# Altium schematic sheet DIPSY_UL1K16.SchDoc: DIPSY EASYSOLDER
size A4; Organization: Trenz Electronic GmbH; DocumentNumber: 1; Revision: 02; SheetNumber: 1; SheetTotal: 1; Date: 2015-09-20; Author: Antti Lukats; DrawnBy: Antti Lukats; Engineer: Antti Lukats
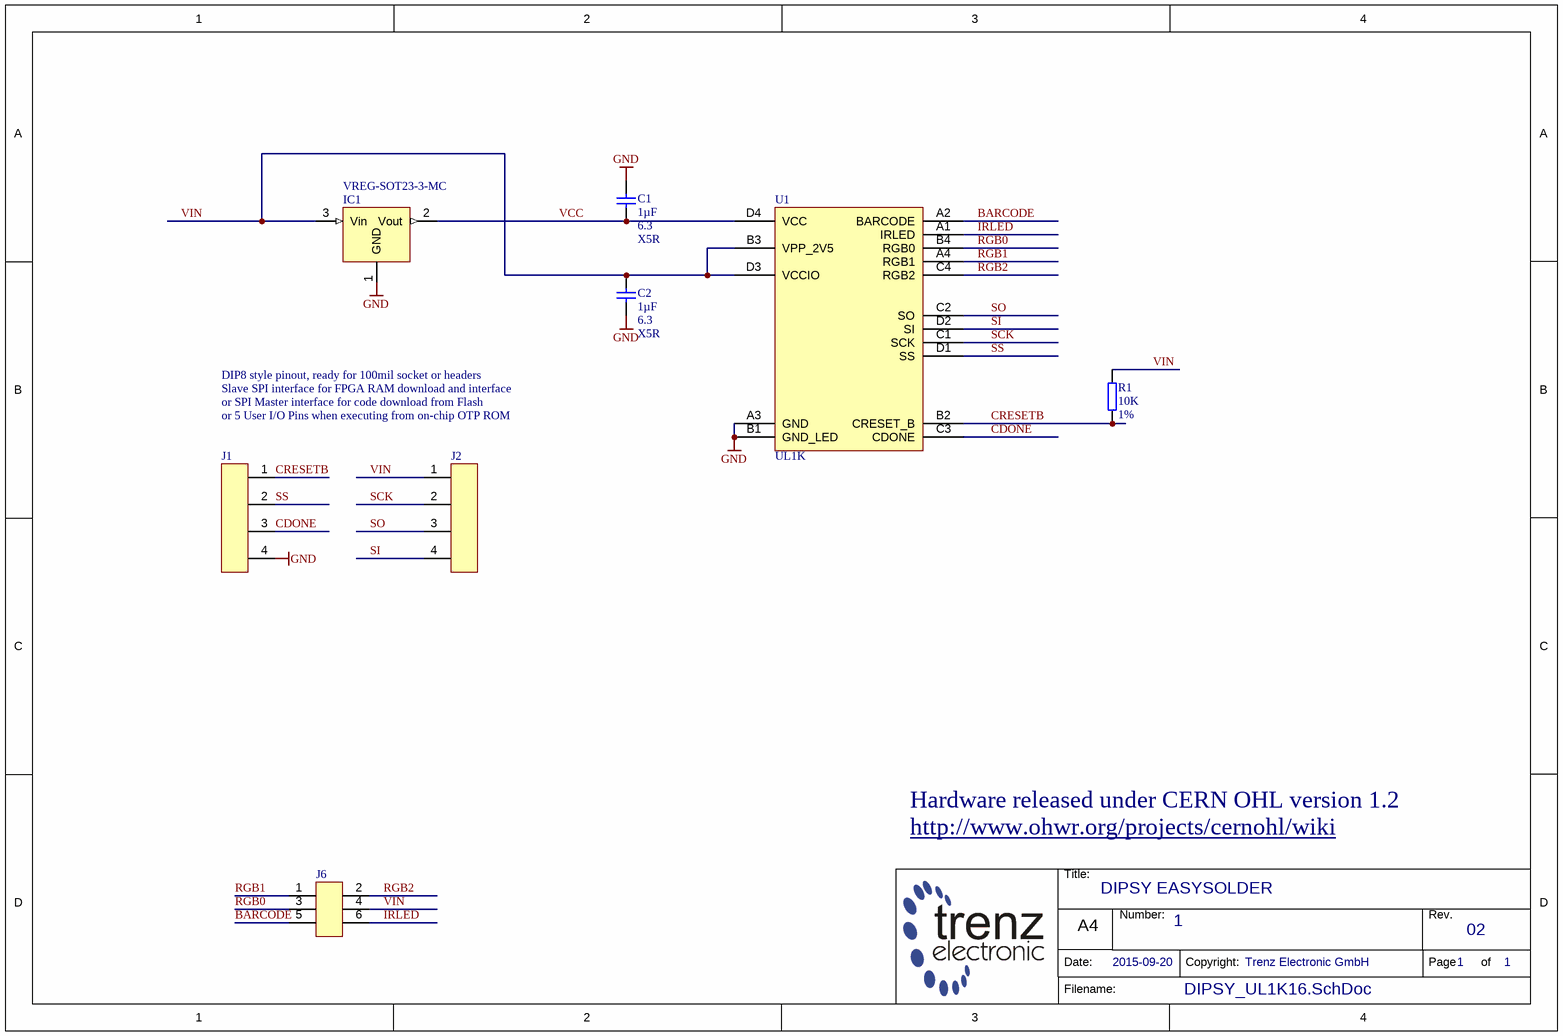
[diagram p0: DIPSY_UL1K16.SchDoc]

## Parts
C1  1µF  Voltage: 6.3  Technology: X5R  [CAPC1005X55N]
C2  1µF  Voltage: 6.3  Technology: X5R  [CAPC1005X55N]
IC1  VREG-SOT23-3-MC  [SOT23]
J1  Pin Header 2.54 1Row 4Pins  [STIFTLEISTE2_54 OG 1R-4]  (value not drawn)
J2  Pin Header 2.54 1Row 4Pins  [STIFTLEISTE2_54 OG 1R-4]  (value not drawn)
J6  Pin Header 2.54 2Row 6Pins  [STIFTLEISTE2_54 OG 2R-6]  (value not drawn)
R1  10K  Tolerance: 1%  [RESC1005X40N]
U1  UL1K  [BGA16C35P4X4_140X140X100]

## Nets
GND: C1.1 C2.2 IC1.1(GND) J1.4 U1.A3(GND) U1.B1(GND_LED)
BARCODE: J6.5 U1.A2(BARCODE)
CDONE: J1.3 U1.C3(CDONE)
CRESETB: J1.1 R1.2 U1.B2(CRESET_B)
IRLED: J6.6 U1.A1(IRLED)
RGB0: J6.3 U1.B4(RGB0)
RGB1: J6.1 U1.A4(RGB1)
RGB2: J6.2 U1.C4(RGB2)
SCK: J2.2 U1.C1(SCK)
SI: J2.4 U1.D2(SI)
SO: J2.3 U1.C2(SO)
SS: J1.2 U1.D1(SS)
VCC: C1.2 IC1.2(Vout) U1.D4(VCC)
VIN: C2.1 IC1.3(Vin) J2.1 J6.4 R1.1 U1.B3(VPP_2V5) U1.D3(VCCIO)

## Notes on the sheet
- DIP8 style pinout, ready for 100mil socket or headers
- Slave SPI interface for FPGA RAM download and interface
- or SPI Master interface for code download from Flash
- or 5 User I/O Pins when executing from on-chip OTP ROM
- Hardware released under CERN OHL version 1.2
- http://www.ohwr.org/projects/cernohl/wiki
- Title:
- Number:
- Rev.
- Date:
- A4
- Copyright:
- Page
- of
- Filename:

## Library data of the parts
C1 C2 = 23453: KON 1µF 6.3V X5R SMD 10%; AN: 23453; Mixed: SMT; Value: 1u; Preferred: Yes; Case: 1005 (0402); Tolerance: 10%
IC1 = VREG-SOT23-3-MC: ID: 1; Case: SOT23; FARNELL: *; Value: VREG-SOT23-3-MC; Component: VREG-SOT23-3-MC
J1 J2 = 23162: Stiftleiste gerade 1-reihig, 4pol.; AN: 23162; Mixed: THT; Trenz-Stock: Yes
J6 = 22334: Stiftleiste gerade 2-reihig, 6pol.; AN: 22334; Mixed: THT; Trenz-Stock: Yes
R1 = 22750: WID SMD 10K 1% 0,063W; AN: 22750; Mixed: SMT; Preferred: Yes; Case: 1005 (0402); Value: 10K